# EAGLE schematic Schematic (EAGLE 9.7.0)
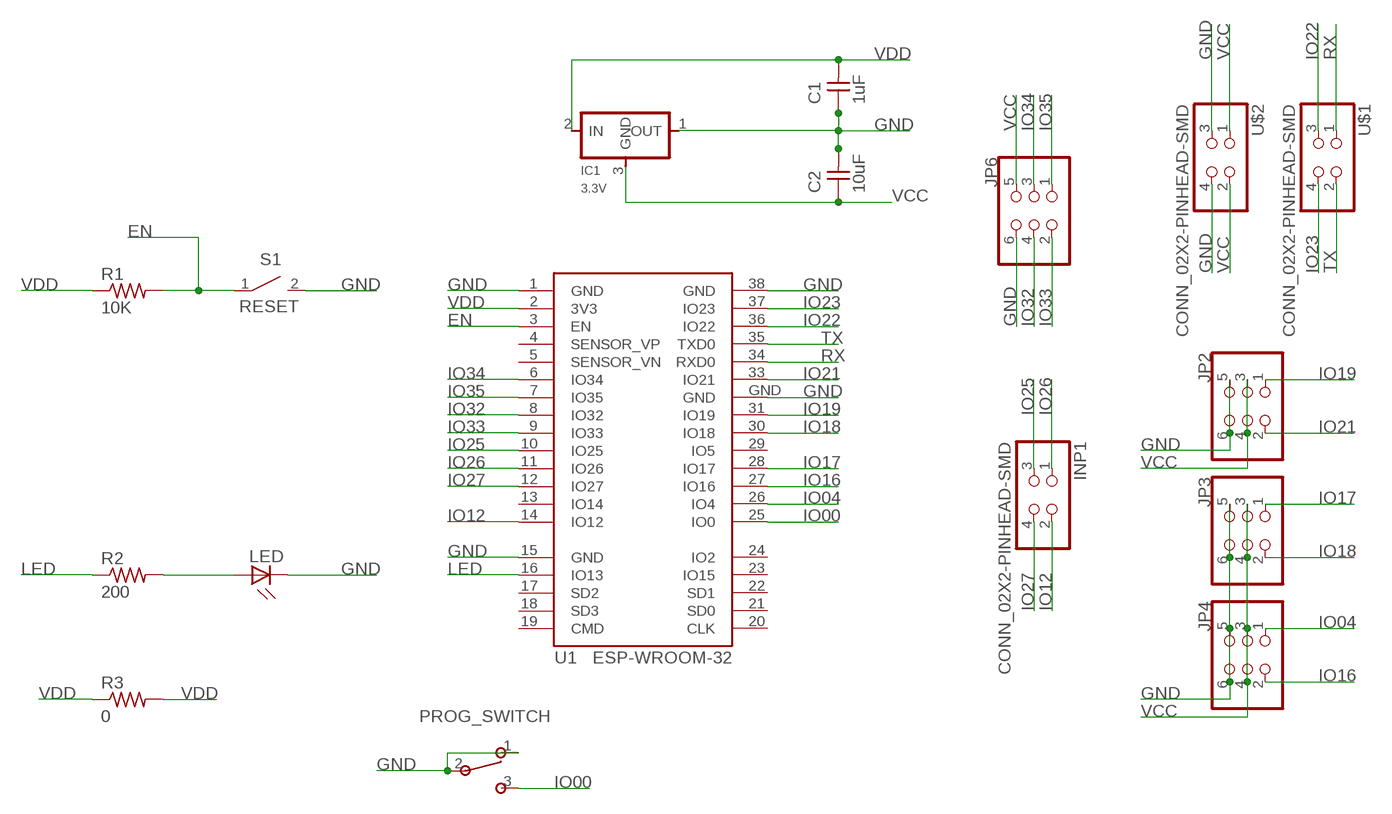
[diagram p0: schematic, sheet 1]

## Parts
C1  1uF  CAP_UNPOLARIZEDFAB  [C1206FAB]
C2  10uF  CAP_UNPOLARIZEDFAB  [C1206FAB]
IC1  3.3V  VR_REGULATOR-SOT23SOT23  [SOT23]
INP1  CONN_02X2-PINHEAD-SMD  [2X02SMD]
JP2  CONN_03X2-PINHEAD-SMD  [2X03SMD]
JP3  CONN_03X2-PINHEAD-SMD  [2X03SMD]
JP4  CONN_03X2-PINHEAD-SMD  [2X03SMD]
JP6  CONN_03X2-PINHEAD-SMD  [2X03SMD]
LED  LEDFAB1206  [LED1206FAB]
PROG_SWITCH  SW_SLIDE-SWITCH  [AYZ0102AGRLC]
R1  10K  R1206FAB  [R1206FAB]
R2  200  R1206FAB  [R1206FAB]
R3  0  R1206FAB  [R1206FAB]
S1  RESET  B3U-X000B3U-1000P(M)1000P(M)  [B3U-1000P(M)]
U1  ESP-WROOM-32  [ESP-WROOM-32]
U$1  CONN_02X2-PINHEAD-SMD  [2X02SMD]
U$2  CONN_02X2-PINHEAD-SMD  [2X02SMD]

## Nets
EN: R1.2 S1.1 U1.3(EN)
GND: C1.1 C2.2 IC1.1(OUT) JP2.5 JP2.6 JP3.5 JP3.6 JP4.5 JP4.6 JP6.6 LED.2(C) PROG_SWITCH.1 PROG_SWITCH.2 S1.2 U1.1(GND) U1.15(GND) U1.38(GND) U1.GND U$2.3 U$2.4
IO00: PROG_SWITCH.3 U1.25(IO0)
IO04: JP4.1 U1.26(IO4)
IO12: INP1.2 U1.14(IO12)
IO16: JP4.2 U1.27(IO16)
IO17: JP3.1 U1.28(IO17)
IO18: JP3.2 U1.30(IO18)
IO19: JP2.1 U1.31(IO19)
IO21: JP2.2 U1.33(IO21)
IO22: U1.36(IO22) U$1.3
IO23: U1.37(IO23) U$1.4
IO25: INP1.3 U1.10(IO25)
IO26: INP1.1 U1.11(IO26)
IO27: INP1.4 U1.12(IO27)
IO32: JP6.4 U1.8(IO32)
IO33: JP6.2 U1.9(IO33)
IO34: JP6.3 U1.6(IO34)
IO35: JP6.1 U1.7(IO35)
LED: R2.1 U1.16(IO13)
N$1: LED.1(A) R2.2
RX: U1.34(RXD0) U$1.1
TX: U1.35(TXD0) U$1.2
VCC: C2.1 IC1.3(GND) JP2.3 JP2.4 JP3.3 JP3.4 JP4.3 JP4.4 JP6.5 U$2.1 U$2.2
VDD: C1.2 IC1.2(IN) R1.1 R3.1 R3.2 U1.2(3V3)
Unconnected: U1.4(SENSOR_VP) U1.5(SENSOR_VN) U1.13(IO14) U1.17(SD2) U1.18(SD3) U1.19(CMD) U1.20(CLK) U1.21(SD0) U1.22(SD1) U1.23(IO15) U1.24(IO2) U1.29(IO5)

## Library data of the parts
C1 C2 = fab:CAP_UNPOLARIZED
IC1 = fab:VR_REGULATOR-SOT23
INP1 U$1 U$2 = fab:CONN_02X2-PINHEAD-SMD
JP2-JP4 JP6 = fab:CONN_03X2-PINHEAD-SMD: PIN HEADER
LED = fab:LED: LED
PROG_SWITCH = fab:SW_SLIDE-SWITCH: SMD slide-switch AYZ0102AGRLC as found in the fablab inventory. Includes the mounting holes. Made by Zaerc.
R1-R3 = fab:R: Resistor (US Symbol) Variants with postfix FAB are widened to allow the routing of internal traces
S1 = Switch:B3U-X000: Ultra-small Tactile Switch Contact form : SPST-NO Datasheet <https://omronfs.omron.com/en_US/ecb/products/pdf/en-b3u.pdf>; CATEGORY: SWITCH; DESCRIPTION: Ultra-small Surface-mounting Tactile Switches with High Contact Reliability; MANUFACTURER: OMRON; OPERATING_TEMPERATURE: -25°C to +70°C at 60%RH max; PART_STATUS: ACTIVE; ROHS_COMPLIANCE: RoHS Compliant; SERIES: B3U; TYPE: Tactile; VALUE: B3U-1000P(M)
U1 = esp32:ESP-WROOM-32: Espressif Systems ESP-WROOM-32